# EAGLE design Four_Track_R0 (EAGLE 9.6.2)
TITLE: Four Track
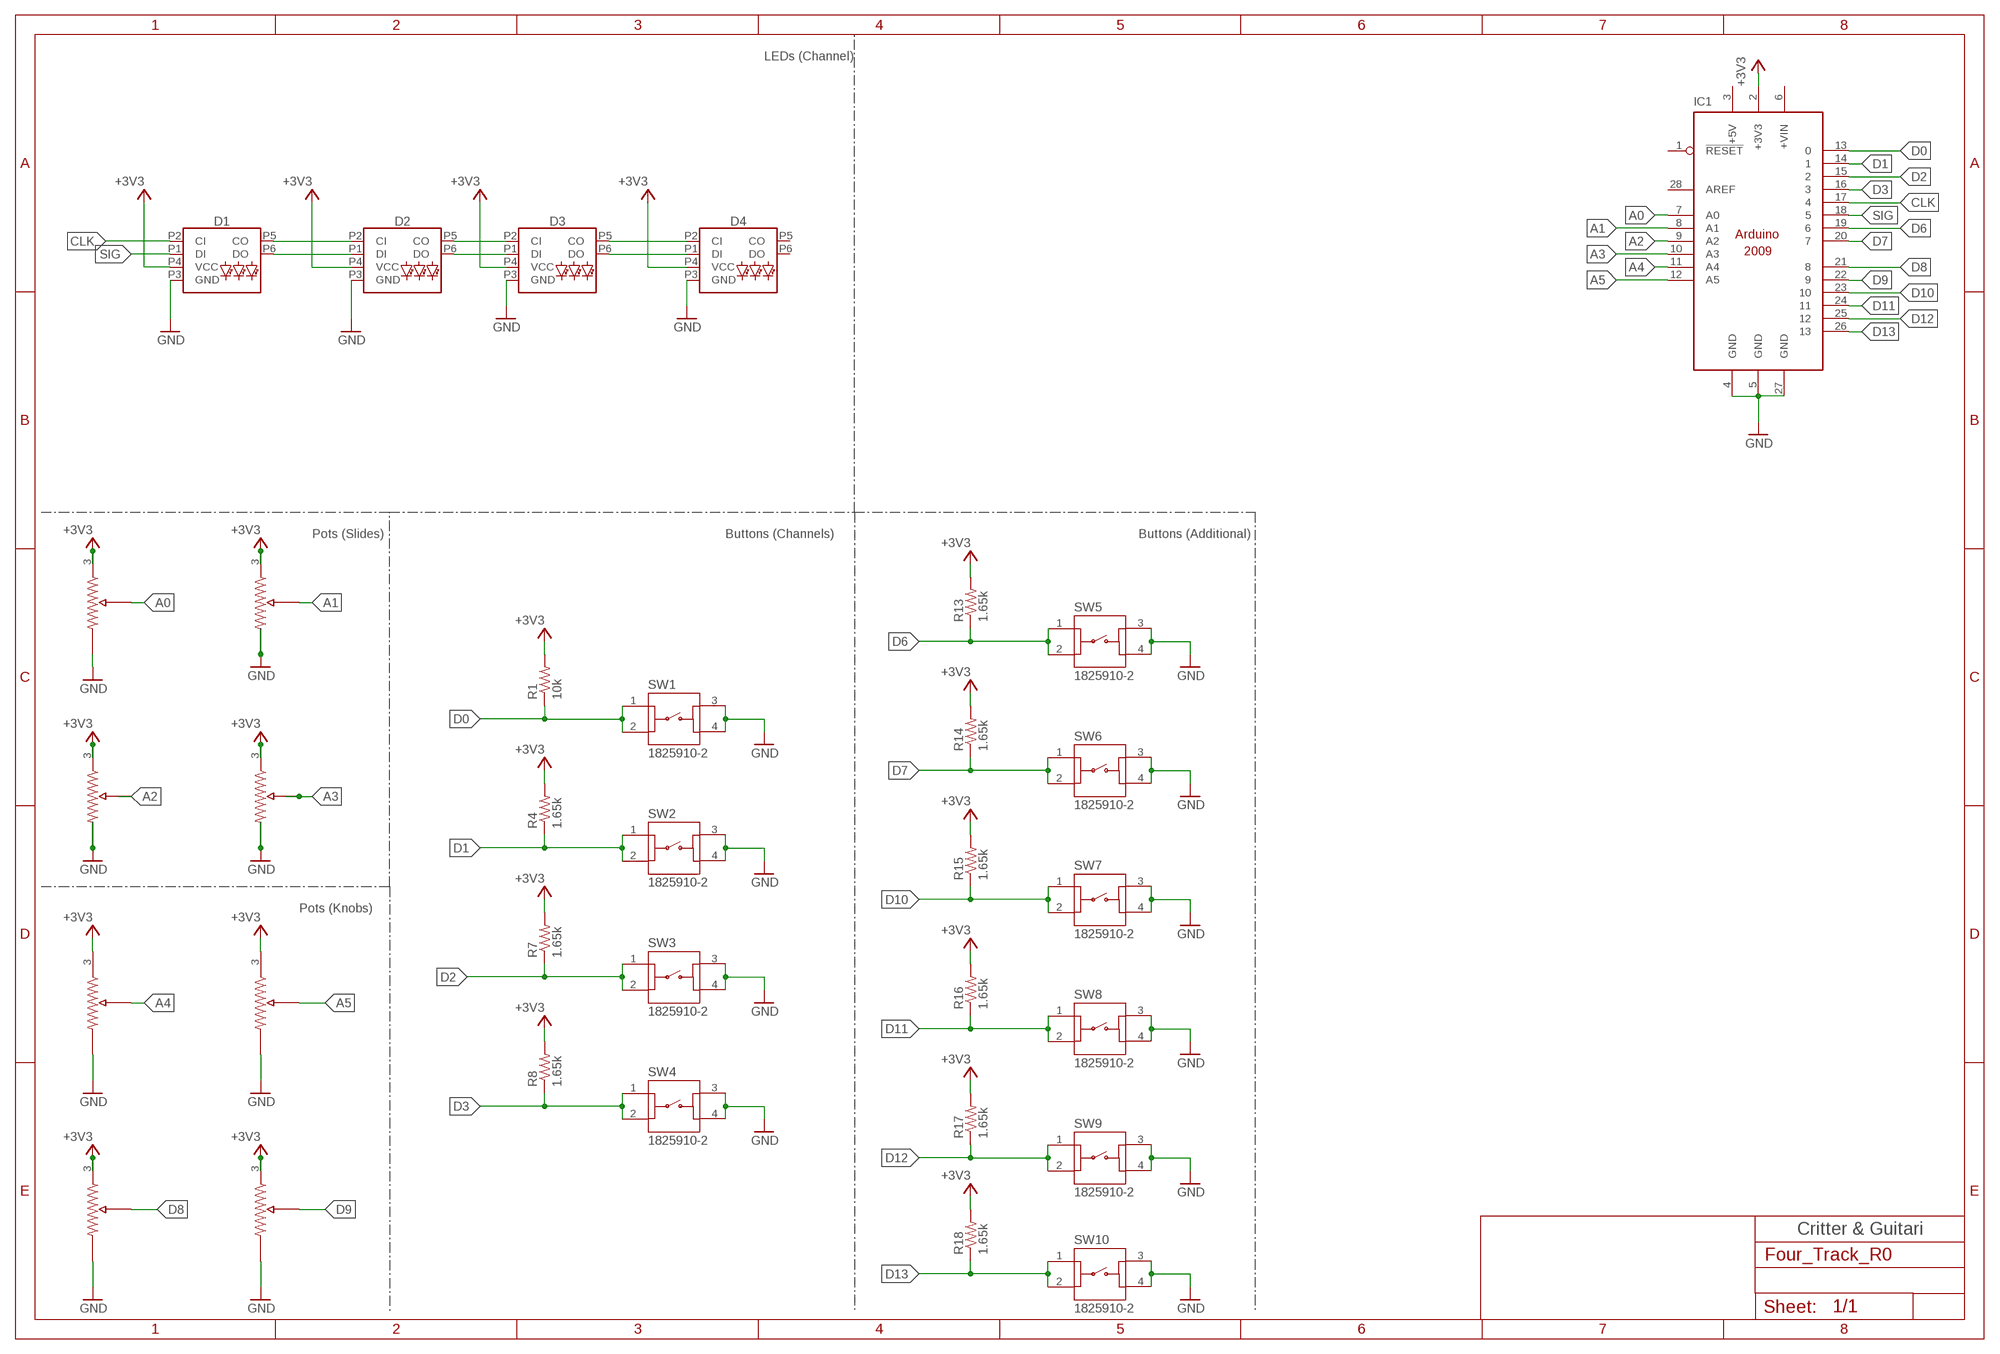
[diagram p0: schematic, sheet 1]

## Parts
D1  SPARKFUN-LED_APA102-5050  [SPARKFUN-LED_APA102-5050]
D2  SPARKFUN-LED_APA102-5050  [SPARKFUN-LED_APA102-5050]
D3  SPARKFUN-LED_APA102-5050  [SPARKFUN-LED_APA102-5050]
D4  SPARKFUN-LED_APA102-5050  [SPARKFUN-LED_APA102-5050]
IC1  ARDUINO2009_10  [ARDUINO2009]
R1  10k  R-US_R0603  [R0603]
R2  POTPTA45  [SLIDE_POT_PTA4543]
R3  POTPTA45  [SLIDE_POT_PTA4543]
R4  1.65k  R-US_R0603  [R0603]
R5  POTPTA45  [SLIDE_POT_PTA4543]
R6  POTVERT  [POT-P09X-VERT]
R7  1.65k  R-US_R0603  [R0603]
R8  1.65k  R-US_R0603  [R0603]
R9  POTVERT  [POT-P09X-VERT]
R10  POTVERT  [POT-P09X-VERT]
R11  POTPTA45  [SLIDE_POT_PTA4543]
R12  POTVERT  [POT-P09X-VERT]
R13  1.65k  R-US_R0603  [R0603]
R14  1.65k  R-US_R0603  [R0603]
R15  1.65k  R-US_R0603  [R0603]
R16  1.65k  R-US_R0603  [R0603]
R17  1.65k  R-US_R0603  [R0603]
R18  1.65k  R-US_R0603  [R0603]
SW1  1825910-2  [TE_1825910-2]
SW2  1825910-2  [TE_1825910-2]
SW3  1825910-2  [TE_1825910-2]
SW4  1825910-2  [TE_1825910-2]
SW5  1825910-2  [TE_1825910-2]
SW6  1825910-2  [TE_1825910-2]
SW7  1825910-2  [TE_1825910-2]
SW8  1825910-2  [TE_1825910-2]
SW9  1825910-2  [TE_1825910-2]
SW10  1825910-2  [TE_1825910-2]

## Nets
+3V3: D1.P4(VCC) D2.P4(VCC) D3.P4(VCC) D4.P4(VCC) IC1.2(+3V3) R1.2 R2.3 R3.3 R4.2 R5.3 R6.3 R7.2 R8.2 R9.3 R10.3 R11.3 R12.3 R13.2 R14.2 R15.2 R16.2 R17.2 R18.2
A0 [Analog IO]: IC1.7(A0) R11.2
A1 [Analog IO]: IC1.8(A1) R5.2
A2 [Analog IO]: IC1.9(A2) R2.2
A3 [Analog IO]: IC1.10(A3) R3.2
A4 [Analog IO]: IC1.11(A4) R9.WIPER
A5 [Analog IO]: IC1.12(A5) R10.WIPER
CLK [Digital IO]: D1.P2(CI) IC1.17
D0 [Digital IO]: IC1.13 R1.1 SW1.1 SW1.2
D1 [Digital IO]: IC1.14 R4.1 SW2.1 SW2.2
D2 [Digital IO]: IC1.15 R7.1 SW3.1 SW3.2
D3 [Digital IO]: IC1.16 R8.1 SW4.1 SW4.2
D6 [Digital IO]: IC1.19 R13.1 SW5.1 SW5.2
D7 [Digital IO]: IC1.20 R14.1 SW6.1 SW6.2
D8 [Digital IO]: IC1.21 R6.WIPER
D9 [Digital IO]: IC1.22 R12.WIPER
D10 [Digital IO]: IC1.23 R15.1 SW7.1 SW7.2
D11 [Digital IO]: IC1.24 R16.1 SW8.1 SW8.2
D12 [Digital IO]: IC1.25 R17.1 SW9.1 SW9.2
D13: IC1.26 R18.1 SW10.1 SW10.2
GND: D1.P3(GND) D2.P3(GND) D3.P3(GND) D4.P3(GND) IC1.4(GND) IC1.5(GND) IC1.27(GND) R2.1 R3.1 R5.1 R6.1 R9.1 R10.1 R11.1 R12.1 SW1.3 SW1.4 SW2.3 SW2.4 SW3.3 SW3.4 SW4.3 SW4.4 SW5.3 SW5.4 SW6.3 SW6.4 SW7.3 SW7.4 SW8.3 SW8.4 SW9.3 SW9.4 SW10.3 SW10.4
N$2: D1.P5(CO) D2.P2(CI)
N$3: D1.P6(DO) D2.P1(DI)
N$4: D2.P6(DO) D3.P1(DI)
N$5: D2.P5(CO) D3.P2(CI)
N$6: D3.P6(DO) D4.P1(DI)
N$7: D3.P5(CO) D4.P2(CI)
SIG [Digital IO]: D1.P1(DI) IC1.18
Unconnected: D4.P5(CO) D4.P6(DO) IC1.1(!RESET) IC1.6(+VIN) IC1.28(AREF)

## Notes on the sheet
- LEDs (Channel)
- Pots (Slides) | Buttons (Channels) | Buttons (Additional)
- Pots (Knobs)
- Critter & Guitari

## Power pins joined to a net without a drawn wire
+5V: IC1.3(+5V)

## Library data of the parts
D1-D4 = LED_APA102-2020:SPARKFUN-LED_APA102: APA102 Addressable RGB LED Used in manufacturing of various products at SparkFun Packages: 5050 2020 SparkFun Products: SparkFun Lumenati Boards <https://www.sparkfun.com/categories/405>; CID: 445; PROD_ID: DIO-13739
IC1 = arduino:ARDUINO2009_1: The Arduino Duemilanove ("2009") is a microcontroller board based on the ATmega168 or ATmega328. - 14 digital input/output pins (of which 6 can be used as PWM outputs) - 6 analog inputs, a 16 MHz crystal oscillator - USB connection - power jack - ISP header - reset button It contains everything needed to support the microcontroller; simply connect it to a computer with a USB cable or power it with a AC-to-DC adapter or battery to get started http://arduino.cc/en/Main/ArduinoBoardDuemilanove
R1 R4 R7 R8 R13-R18 = rcl:R-US_: RESISTOR, American symbol; CID: 251; SPICEPREFIX: R
R2 R3 R5 R11 = osborn:POT; CID: 444
R6 R9 R10 R12 = osborn:POT; CID: 161
SW1-SW10 = Switches:1825910-2: SWITCH TACTILE SPST-NO 0.05A 24V Check prices <https://pricing.snapeda.com/parts/1825910-2/TE%20Connectivity/view-part?ref=eda>; AVAILABILITY: In Stock; CID: 446; COMMENT: 1825910-2; CONFIGURATION_POLE-THROW: Single Pole - Single Throw; CONTACT_CURRENT_RATING: 50 mA; DESCRIPTION: 50 mA SPST Round Actuator 160 Gram Force Tactile Pushbutton Switch; EU_ROHS_COMPLIANCE: Compliant; MF: TE Connectivity; MP: 1825910-2; PACKAGE: None; PRICE: None; PURCHASE-URL: https://pricing.snapeda.com/search/part/1825910-2/?ref=eda

## Board
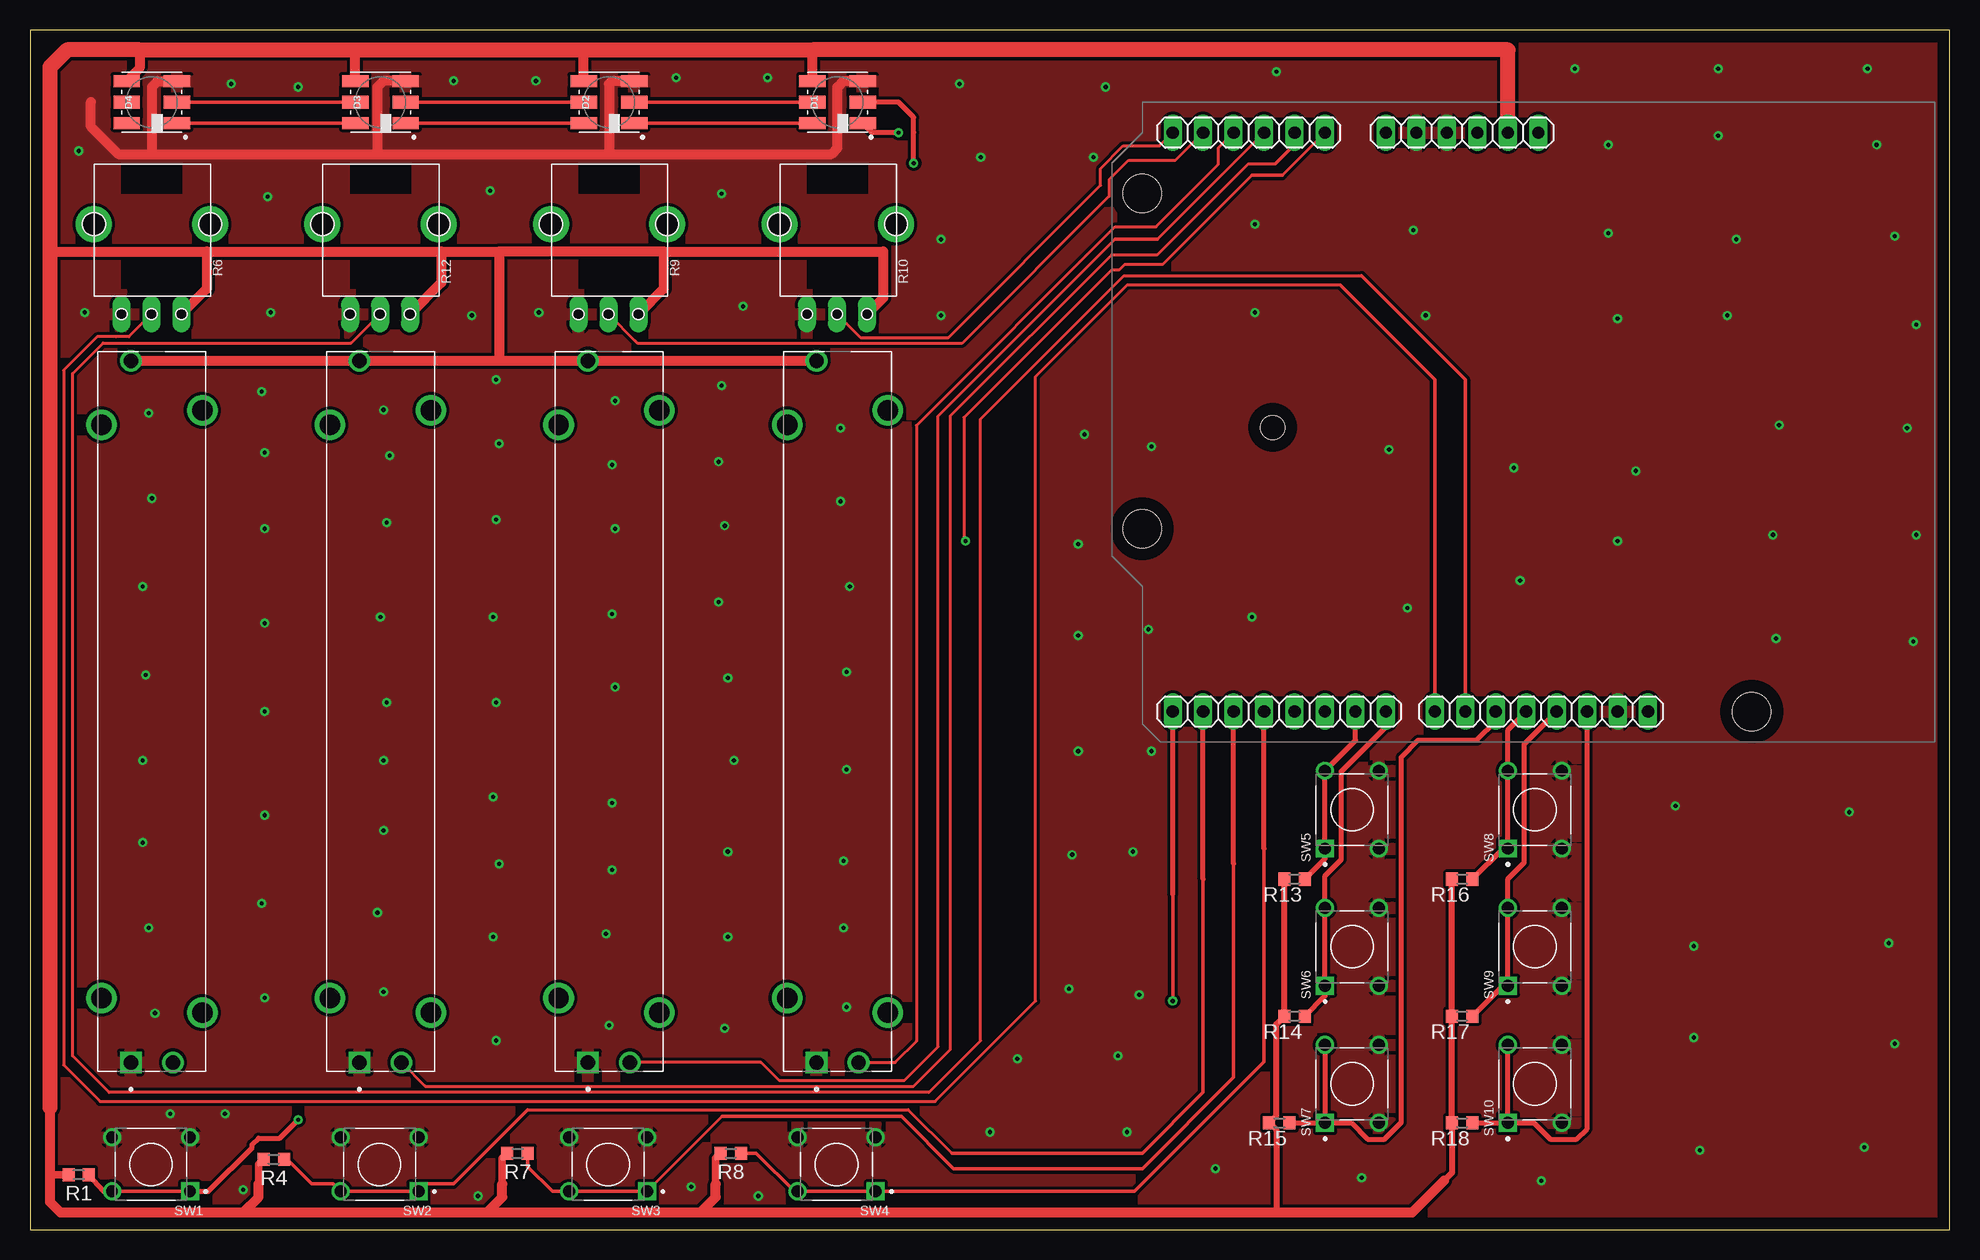
[diagram p1: board, top side]
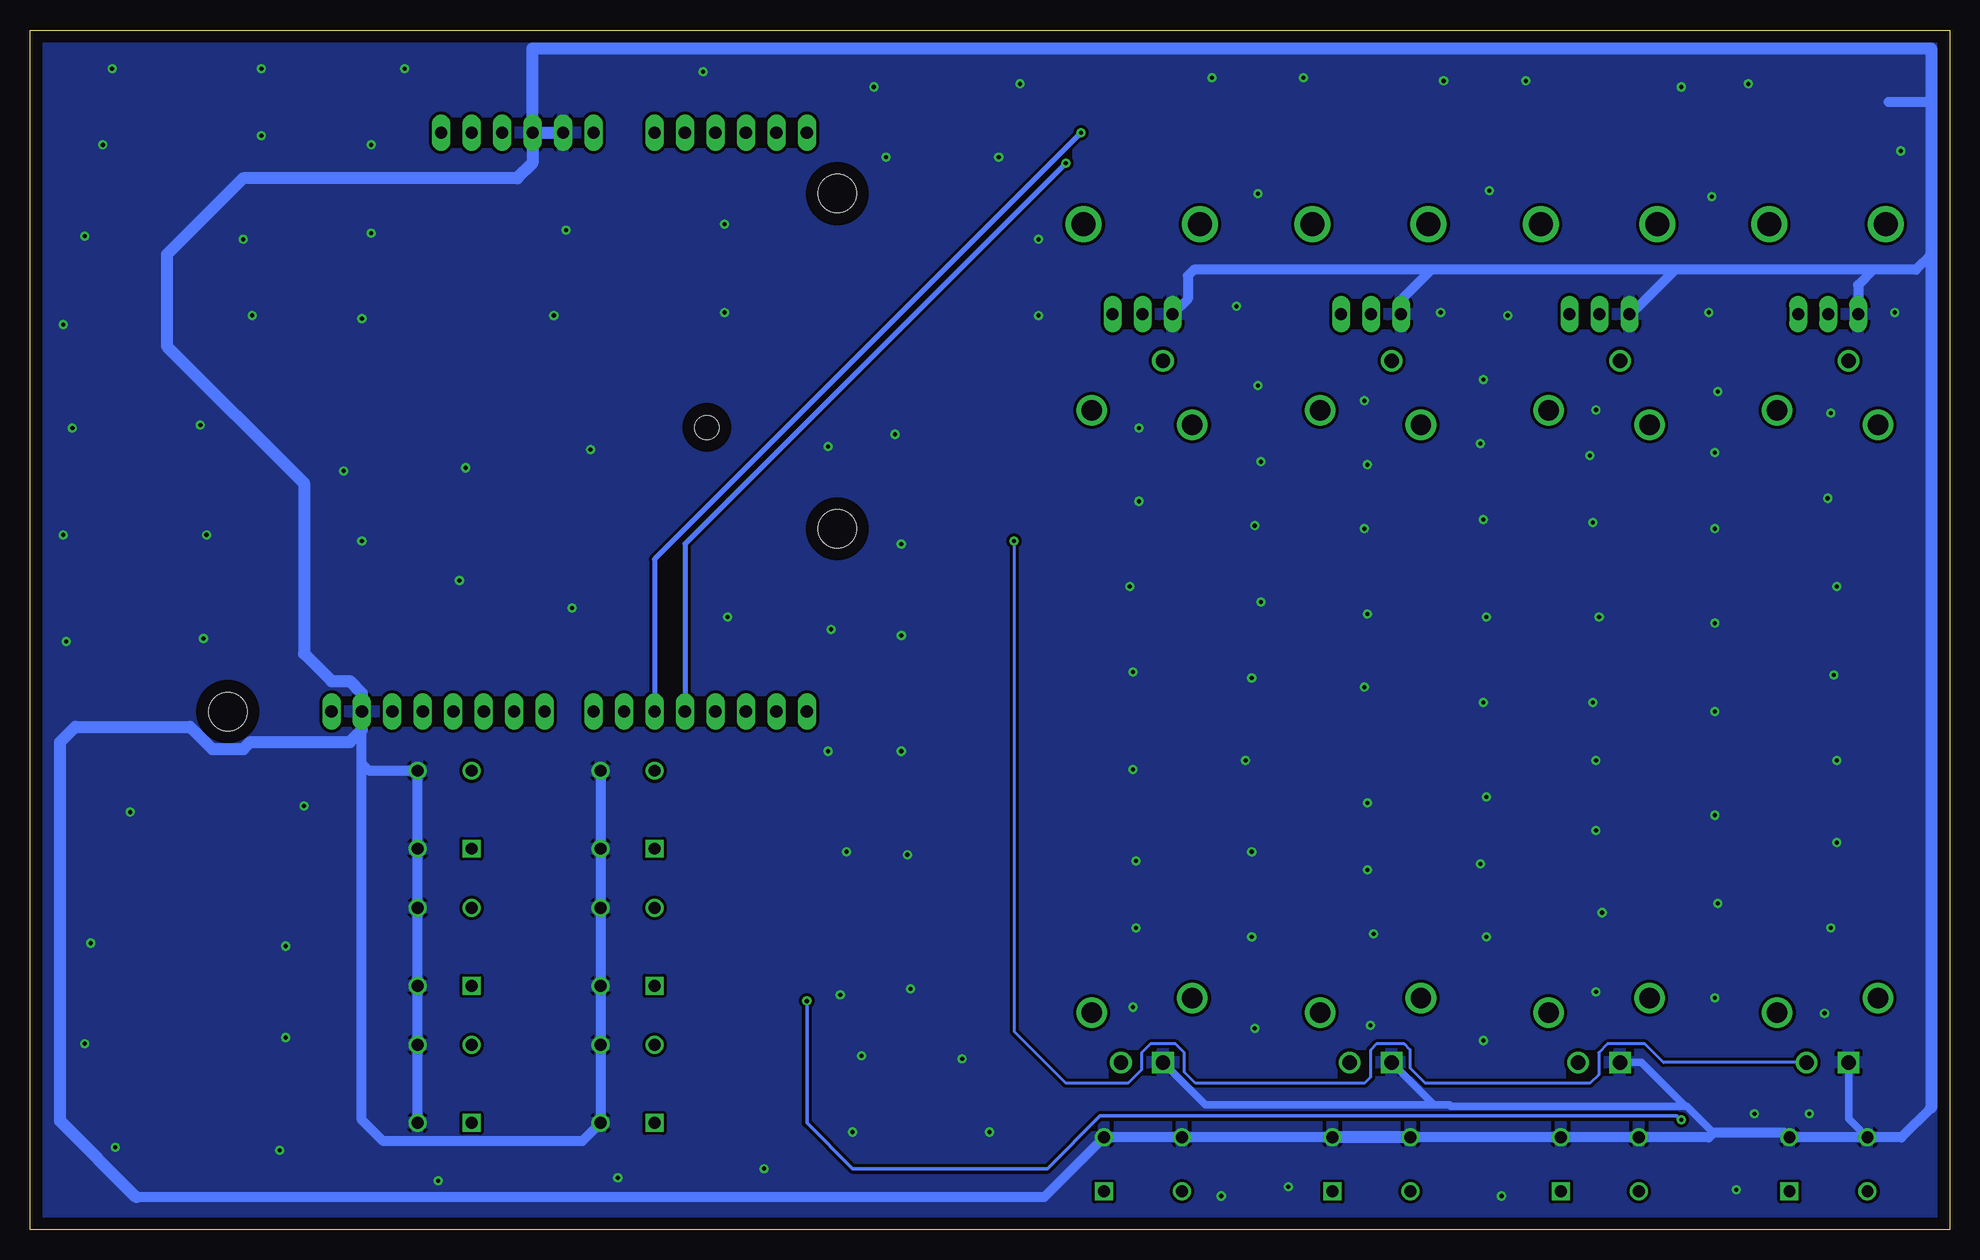
[diagram p2: board, bottom side, seen from below]

Size 160 x 100 mm. Coordinates in mm from the lower left corner, seen from the top.
Outline: 0,0 160,0 160,100 0,100 0,0
Copper layers (1*16): Top 0.035mm / dielectric 0.5mm / Bottom 0.035mm
Design rules "default *": minimum track width 10mil, minimum drill 0.35mm, track to track 10mil, track to pad 10mil, pad to pad 10mil, via to via 10mil, smd to smd 10mil, copper to edge 40mil, drill to drill 6mil, minimum pad ring 10mil, minimum via ring 8mil, stop-mask expansion 4mil, vias tented up to drill 0mil, thermal gap 10mil

### Footprints (pad centres in the part's own frame; a part is rotated, then mirrored left to right if it is on the bottom)
SPARKFUN-LED_APA102-5050 = smd 1 x 2.2: P1 -1.75,-2.1; P3 1.75,-2.1; P4 1.75,2.1; P6 -1.75,2.1 | smd 1.1 x 2.2: P2 0,-2.1; P5 0,2.1
ARDUINO2009 = drill 1.016 long: 1 33.02,2.54; 2 35.56,2.54; 3 38.1,2.54; 4 40.64,2.54; 5 43.18,2.54; 6 45.72,2.54; 7 50.8,2.54; 8 53.34,2.54; 9 55.88,2.54; 10 58.42,2.54; 11 60.96,2.54; 12 63.5,2.54; 13 63.5,50.8; 14 60.96,50.8; 15 58.42,50.8; 16 55.88,50.8; 17 53.34,50.8; 18 50.8,50.8; 19 48.26,50.8; 20 45.72,50.8; 21 41.656,50.8; 22 39.116,50.8; 23 36.576,50.8; 24 34.036,50.8; 25 31.496,50.8; 26 28.956,50.8; 27 26.416,50.8; 28 23.876,50.8 | hole 3.2: 15.24,50.8; 66.04,35.56; 66.04,7.62 | hole 2: 55.17,27.114
R0603 = smd 1 x 1.1: 1 -0.85,0; 2 0.85,0
SLIDE_POT_PTA4543 = drill 1.2 square: 1 -29.25,1.75 | drill 1.2: 2 -29.25,-1.75; 3 29.25,1.75 | drill 1.7: P1 -23.9,4.2; P2 23.9,4.2; P3 -25.1,-4.2; P4 25.1,-4.2
POT-P09X-VERT = drill 1 pad 1.27 long: 1 -2.54,-7.51; 3 2.46,-7.51; WIPER -0.04,-7.51 | drill 2 pad 2.54: P$4 4.86,-0.01; P$5 -4.84,-0.01
TE_1825910-2 = drill 0.99 square: 1 0,0 | drill 0.99: 2 6.5,0; 3 0,-4.5; 4 6.5,-4.5

### Placement (x,y rotation side)
D1  67.31,93.98 90 top
D2  48.26,93.98 90 top
D3  29.21,93.98 90 top
D4  10.16,93.98 90 top
IC1  158.75,93.98 180 top
R1  4.06,4.57 180 top
R2  48.26,43.18 90 top
R3  67.31,43.18 90 top
R4  20.32,5.84 180 top
R5  29.21,43.18 90 top
R6  10.16,83.82 0 top
R7  40.64,6.35 180 top
R8  58.42,6.35 180 top
R9  48.26,83.82 0 top
R10  67.31,83.82 0 top
R11  10.16,43.18 90 top
R12  29.21,83.82 0 top
R13  105.41,29.21 180 top
R14  105.41,17.78 180 top
R15  104.14,8.89 180 top
R16  119.38,29.21 180 top
R17  119.38,17.78 180 top
R18  119.38,8.89 180 top
SW1  13.34,3.17 180 top
SW2  32.38,3.17 180 top
SW3  51.44,3.17 180 top
SW4  70.48,3.17 180 top
SW5  107.95,31.75 90 top
SW6  107.95,20.32 90 top
SW7  107.95,8.89 90 top
SW8  123.19,31.75 90 top
SW9  123.19,20.32 90 top
SW10  123.19,8.89 90 top

### Tracks (layer width: path | path; a pad name or v marks a point on that pad's centre or on a via)
+3V3
  Top 0.508: 103.89,1.42 103.89,8.29 R15.2 103.89,9.49 103.89,17.11 R14.2 R13.2 | R16.2 R17.2 R18.2 118.53,4.74 117.86,4.06
  Top 0.61: 39.37,3.81 39.37,5.93 R7.2 | R8.2 57.15,5.93 57.15,3.81 | R4.2 19.05,5.42 19.05,3.81 | R1.2 1.65,4.57
  Top 0.813: 1.65,10.16 1.65,4.57 1.65,2.31 2.54,1.42 17.78,1.42 | 17.78,1.42 38.1,1.42 | 38.1,1.42 55.88,1.42 | 38.1,1.42 39.37,2.69 39.37,3.81 | 55.88,1.42 57.15,2.69 57.15,3.81 | 17.78,1.42 19.05,2.69 19.05,3.81 | 55.88,1.42 103.89,1.42 115.21,1.42 117.86,4.06 | 9.14,98.35 9.14,96.81 D4.P4 | D3.P4 27.11,98.35 | D2.P4 46.16,98.35 | D1.P4 65.21,98.35 | 1.65,81.53 14.73,81.53 | 14.73,81.53 34.29,81.53 | 34.29,81.53 39.12,81.53 | 52.83,81.53 71.12,81.53 71.12,77.66 R10.3 | 52.83,81.53 39.12,81.53 | R3.3 R2.3 39.12,72.43 | R11.3 R5.3 39.12,72.43 | 39.12,81.53 39.12,72.43 | 34.29,81.53 34.29,78.93 R12.3 | 52.83,81.53 52.83,78.42 R9.3 | 14.73,81.53 14.73,78.42 R6.3
  Top 1.27: 1.65,10.16 1.65,81.53 1.65,96.9 3.1,98.35 9.14,98.35 27.11,98.35 46.16,98.35 65.21,98.35 123.19,98.35 IC1.2
A0  (via drill 0.35)
  Top 0.254: 104.39,87.88 IC1.7 | 101.85,87.88 94.44,80.47 91.25,80.47 90.79,80.01 90.17,80.01 77.85,67.69 77.85,57.53 v77.98,57.4
  Top 0.305: 101.85,87.88 104.39,87.88
  Bottom 0.254: v77.98,57.4 77.98,16.51 73.66,12.19 68.48,12.19 67.35,13.32 67.35,14.73 66.62,15.46 64.5,15.46 63.77,14.73 63.77,13.11 62.85,12.19 48.77,12.19 48.26,12.7 48.26,14.96 47.75,15.46 45.45,15.46 44.98,14.99 44.98,13.46 43.7,12.19 29.97,12.19 29.25,12.91 29.25,14.73 28.52,15.46 25.39,15.46 23.85,13.93 R11.2
A1
  Top 0.254: 103.82,88.85 101.55,88.85 93.98,81.28 90.17,81.28 76.71,67.82 76.71,14.99 73.66,11.94 32.95,11.94 R5.2 | IC1.8 105.41,90.44
  Top 0.305: 105.41,90.44 103.82,88.85
A2
  Top 0.254: 90.42,82.55 75.69,67.82 75.69,15.24 72.9,12.45 62.42,12.45 60.94,13.93 R2.2 | 93.98,82.55 IC1.9
  Top 0.305: 90.42,82.55 93.98,82.55
A3
  Top 0.254: IC1.10 99.06,90.17 99.06,88.8 93.86,83.59 90.45,83.59 73.89,67.03 73.89,15.71 72.11,13.93 R3.2
A4
  Top 0.254: R9.WIPER 50.45,74.08 50.62,73.91 50.67,73.86 77.67,73.86 89.94,86.13 89.94,87.51 91.56,89.13 95.48,89.13 IC1.11
A5
  Top 0.254: IC1.12 94.16,90.35 91.12,90.35 89.23,88.46 89.23,87.05 76.55,74.37 69.21,74.37 R10.WIPER
CLK  (via drill 0.35)
  Top 0.406: v73.66,88.9 73.66,91.44 73.66,92.71 72.39,93.98 71.12,93.98 D1.P2
  Bottom 0.406: v73.66,88.9 105.41,57.15 IC1.17
D0  (via drill 0.35)
  Top 0.305: SW1.2 SW1.1 | v95.25,19.05 95.25,27.94
  Top 0.406: 95.25,27.94 IC1.13 | SW1.2 6.13,3.17 R1.1 | SW1.1 14.86,3.17 18.51,6.83 18.51,7.09 19.04,7.62 20.83,7.62 v22.35,9.14
  Bottom 0.305: v95.25,19.05 95.25,8.89 91.44,5.08 75.18,5.08 70.8,9.46 22.73,9.46 22.64,9.37 22.58,9.37 v22.35,9.14
D1
  Top 0.254: 76.83,6.35 73.2,9.98 41.48,9.98
  Top 0.305: R4.1 21.42,5.84 23.47,3.79 25.27,3.79 SW2.2 SW2.1 33.02,3.81 35.31,3.81 41.48,9.98 | 76.83,6.35 92.71,6.35 97.79,11.43 97.79,29.21
  Top 0.406: 97.79,29.21 IC1.14
D2
  Top 0.254: SW3.1 57.68,9.42
  Top 0.305: SW3.1 SW3.2 43.56,3.17 41.49,5.25 R7.1 | 100.33,30.48 100.33,12.7 92.71,5.08 76.98,5.08 72.64,9.42 57.68,9.42
  Top 0.406: 100.33,30.48 IC1.15
D3
  Top 0.305: R8.1 60.54,6.35 63.84,3.05 64.01,3 64.01,3.17 SW4.2 SW4.1 92.08,3.17 102.87,13.97 102.87,31.75
  Top 0.406: 102.87,31.75 IC1.16
D6
  Top 0.406: R13.1 107.95,30.9 SW5.1 SW5.2 110.49,40.79 IC1.19
D7
  Top 0.406: R14.1 107.95,19.47 SW6.1 SW6.2 107.95,29.5 109.31,30.85 109.31,38.19 113.03,41.91 IC1.20
D8
  Top 0.254: 109.22,78.74 91.44,78.74 83.82,71.12 83.82,19.05 75.44,10.67 5.84,10.67 2.79,13.72 2.79,71.63 5.59,74.42 7.15,74.42 8.23,74.42 R6.WIPER
  Top 0.305: IC1.21 117.09,70.87 109.22,78.74
D9
  Top 0.254: R12.WIPER 26.77,73.91 6.09,73.91 3.56,71.37 3.56,14.48 6.6,11.43 74.93,11.43 79.25,15.75 79.25,67.56 91.19,79.5 111,79.5
  Top 0.305: 111,79.5 119.63,70.87 IC1.22
D10
  Top 0.406: SW7.2 SW7.1 | R15.1 SW7.1 | SW7.1 110.13,8.89 111.48,7.53 112.91,7.53 114.3,8.92 114.3,39.37 115.72,40.79 120.61,40.79 122.17,42.36 IC1.23
D11
  Top 0.406: R16.1 122.77,31.75 SW8.1 SW8.2 123.19,41.66 IC1.24
D12
  Top 0.406: R17.1 122.77,20.32 SW9.1 SW9.2 123.19,29.24 124.55,30.6 124.55,40.48 IC1.25
D13
  Top 0.406: R18.1 SW10.1 | SW10.1 SW10.2 | IC1.26 129.79,8.42 128.91,7.53 126.72,7.53 125.37,8.89 SW10.1
GND  (via drill 0.35)
  Top 0.813: 5.08,93.98 5.08,91.95 7.37,89.66 9.91,89.66 | 9.91,89.66 10.16,89.92 10.16,95.25 10.64,95.73 D4.P3 | 9.91,89.66 28.96,89.66 | 28.96,89.66 48.26,89.66 | 48.26,89.66 66.8,89.66 67.31,90.17 67.31,95.25 67.82,95.76 69.38,95.76 D1.P3 | D3.P3 31.28,95.76 29.46,95.76 28.96,95.25 28.96,89.66 | D2.P3 48.49,95.73 48.26,95.5 48.26,89.66
  Bottom 0.61: SW1.4 8.41,9.25 R11.1 | R5.1 25.68,13.93 22,10.25 | 22,10.25 21.88,10.25 19.68,8.06 | R2.1 42.96,10.38 | 22,10.25 41.56,10.25 41.69,10.38 42.96,10.38 | R3.1 62.01,10.38 42.96,10.38
  Bottom 0.813: 22.86,80.01 26.56,76.31 R12.1 | 22.86,80.01 43.18,80.01 | 43.18,80.01 45.72,77.47 R9.1 | 43.18,80.01 62.99,80.01 63.5,79.5 63.5,77.58 R10.1 | 1.52,81.28 2.79,80.01 6.35,80.01 | 6.35,80.01 7.62,78.74 R6.1 | 6.35,80.01 22.86,80.01 | 1.52,10.16 4.01,7.67 SW1.4 SW1.3 13.72,8.06 19.68,8.06 20.07,7.67 SW2.4 SW2.3 SW3.4 | 151.13,2.69 75.47,2.69 SW4.3 SW4.4 SW3.3 | 1.52,93.98 5.08,93.98 | 132.33,38.86 132.33,9.14 130.56,7.37 113.97,7.37 SW7.3 SW7.4 SW6.3 SW6.4 SW5.3 SW5.4 | 132.33,38.86 132.33,41.66 | SW10.3 SW10.4 SW9.3 SW9.4 SW8.3 SW8.4 131.72,38.25 132.33,38.86
  Bottom 1.016: IC1.4 118.11,88.9 119.38,87.63 142.24,87.63 148.59,81.28 148.59,73.66 137.16,62.23 137.16,48.01 134.87,45.72 133.35,45.72 132.33,44.7 IC1.27 132.33,41.66 133.35,40.64 141.63,40.64 142.22,40.06 144.8,40.06 146.66,41.91 156.21,41.91 157.48,40.64 157.48,9.04 151.13,2.69 | IC1.4 118.11,98.48 1.52,98.48 1.52,93.98 1.52,81.28 1.52,10.16 | IC1.4 IC1.5 | SW3.4 SW3.3
  other vias: 19.3,69.85 19.56,64.77 19.56,58.42 19.56,50.55 19.56,43.18 19.56,34.54 19.3,27.18 19.56,19.3 10.41,18.03 9.91,25.15 9.4,32.26 9.4,39.12 9.65,46.23 9.4,53.59 10.16,60.96 9.91,68.07 29.46,68.33 29.97,64.52 29.72,58.93 29.21,51.05 29.72,43.94 29.46,39.12 29.46,33.27 28.96,26.42 29.46,19.81 38.86,15.75 38.61,24.38 38.61,36.07 39.12,30.48 38.86,43.94 38.61,51.05 38.86,59.18 39.12,65.53 38.86,70.87 20.07,76.45 4.57,76.45 42.42,76.45 19.81,86.11 4.06,89.92 16.76,95.5 22.35,95.25 35.31,95.76 42.16,95.76 53.85,96.01 61.47,96.01 38.35,86.61 57.66,86.36 36.83,76.2 59.44,76.96 75.95,76.2 48.77,69.09 48.51,63.75 48.77,58.42 48.51,51.31 48.77,45.21 48.51,35.56 48.51,29.97 48.01,24.64 48.26,17.02 57.91,16.76 58.17,24.38 58.17,31.5 58.67,39.12 58.17,45.97 57.4,52.32 57.91,58.67 57.4,64.01 57.66,70.36 67.56,66.8 67.56,60.71 68.33,53.59 68.07,46.48 68.07,38.35 67.82,30.73 67.82,25.15 68.07,18.54 60.71,2.79 55.12,3.56 37.34,2.79 17.78,3.3 11.68,9.65 16.26,9.65 80.01,8.13 91.44,8.13 82.3,14.22 90.68,14.48 86.61,20.07 92.46,19.56 86.87,31.24 91.95,31.5 87.38,39.88 93.47,39.88 87.38,49.53 93.22,50.04 87.38,57.15 87.88,66.29 93.47,65.28 77.47,95.5 89.66,95.25 103.89,96.52 79.25,89.41 88.65,89.41 75.95,82.55 128.78,96.77 140.72,96.77 153.16,96.77 131.57,90.42 140.72,91.19 153.92,90.42 102.11,83.82 115.32,83.31 131.57,83.06 142.24,82.55 155.45,82.8 102.11,76.45 116.33,76.2 132.33,75.95 141.48,76.2 157.23,75.44 156.46,66.8 157.23,57.91 156.97,49.02 145.54,49.28 145.29,57.91 145.8,67.06 123.7,63.5 133.86,63.25 113.28,65.02 114.81,51.82 101.85,51.05 124.21,54.1 132.33,57.4 137.16,35.31 151.64,34.8 138.68,23.62 154.94,23.88 138.68,16 155.45,15.49 139.19,6.6 152.91,6.86 98.81,5.08 111,4.32 125.98,4.06
  pour Top: -2.29,104.9 166.12,104.9 166.12,-4.32 -2.29,-4.32 -2.29,104.65
  pour Bottom: -1.02,103.63 167.39,103.63 167.39,-5.59 -1.02,-5.59 -1.02,103.38
N$2
  Top 0.305: D1.P5 D2.P2
N$3
  Top 0.305: D1.P6 D2.P1
N$4
  Top 0.305: D2.P6 D3.P1
N$5
  Top 0.305: D2.P5 D3.P2
N$6
  Top 0.305: D3.P6 D4.P1
N$7
  Top 0.254: 12.45,93.98 D4.P2
  Top 0.305: D3.P5 12.45,93.98
SIG  (via drill 0.35)
  Top 0.406: v72.39,91.44 70.2,91.44 D1.P1
  Bottom 0.406: v72.39,91.44 107.95,55.88 IC1.18